# Altium schematic sheet GSM_GPS.SchDoc
size A4
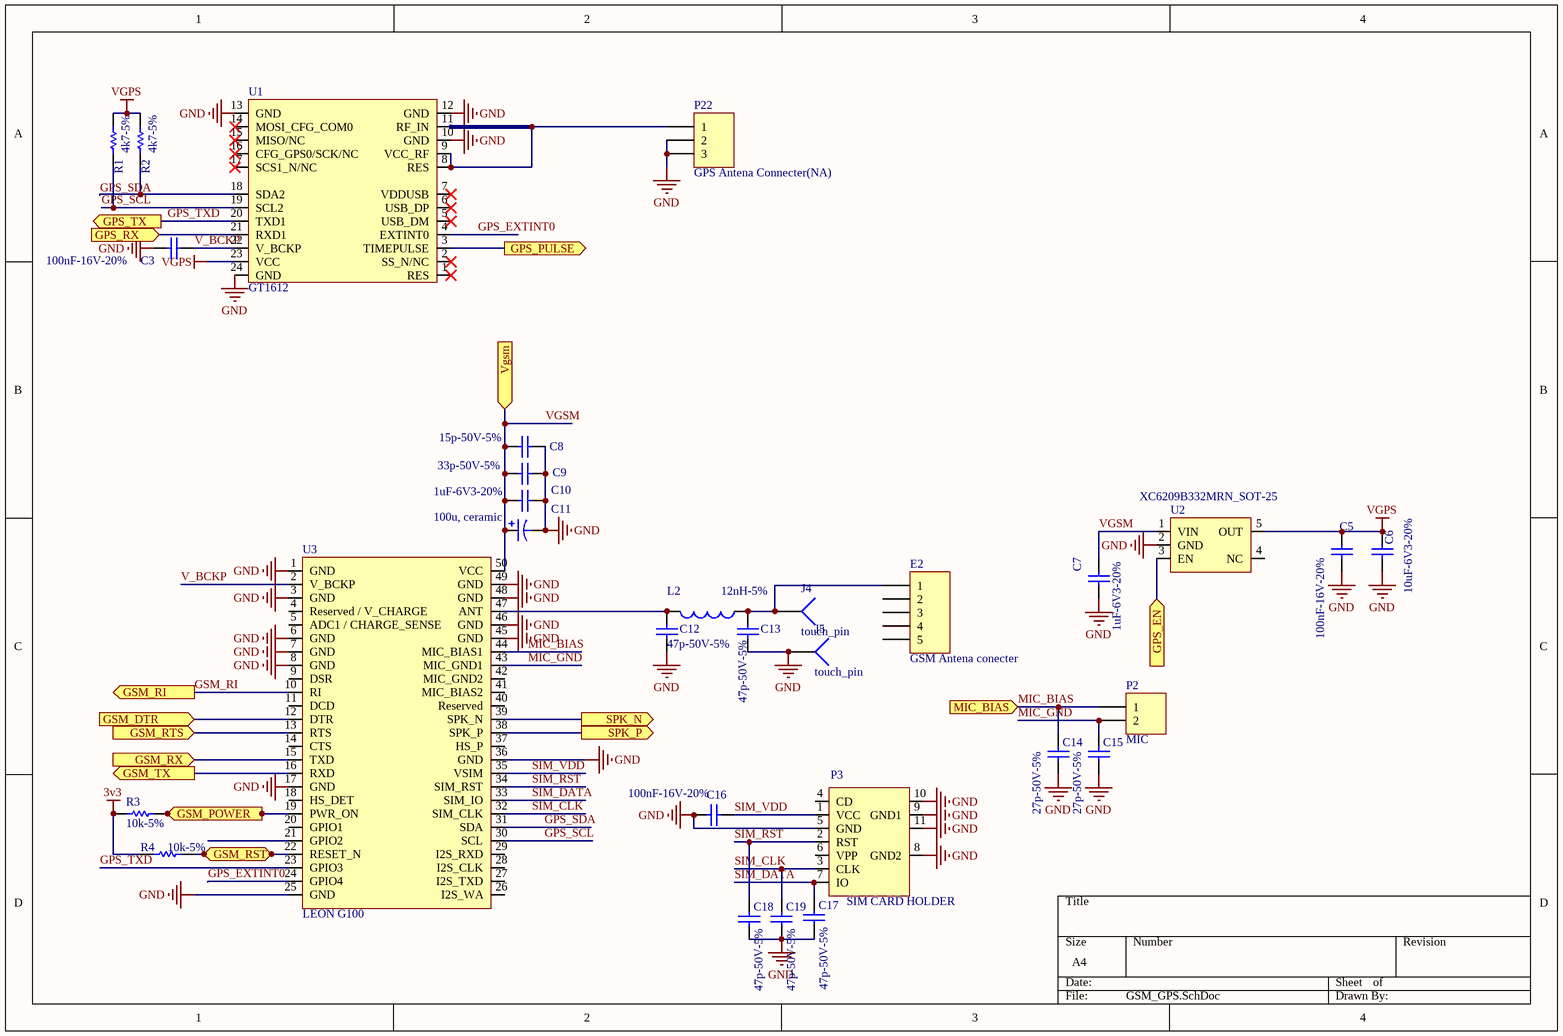
[diagram p0: GSM_GPS.SchDoc]

## Parts
C3  100nF-16V-20%  [C0402]
C5  100nF-16V-20%  [C0402]
C6  10uF-6V3-20%  [C0603]
C7  1uF-6V3-20%  [C0402]
C8  15p-50V-5%  [C0402]
C9  33p-50V-5%  [C0402]
C10  1uF-6V3-20%  [C0402]
C11  100u, ceramic  [C1210]
C12  47p-50V-5%  [C0402]
C13  47p-50V-5%  [C0402]
C14  27p-50V-5%  [C0402]
C15  27p-50V-5%  [C0402]
C16  100nF-16V-20%  [C0402]
C17  47p-50V-5%  [C0402]
C18  47p-50V-5%  [C0402]
C19  47p-50V-5%  [C0402]
E2  GSM Antena conecter  [A10343-GSM850/900/1800/1900/WCDMA]
J4  touch_pin  [TOUCH_PIN]
J5  touch_pin  [TOUCH_PIN]
L2  12nH-5%  [R0402]
P2  MIC  [HEADER_1.27mm_2PIN]
P3  SIM CARD HOLDER  [MICRO_SIM_SOCKET]
P22  GPS Antena Connecter(NA)  [IPX SMD PCB Plug]
R1  4k7-5%  [R0402]
R2  4k7-5%  [R0402]
R3  10k-5%  [R0402]
R4  10k-5%  [R0402]
U1  GT1612  [GT1612]
U2  XC6209B332MRN_SOT-25  [SOT23-5]
U3  LEON G100  [U-BLOX-G100]

## Ports
GPS_EN (in), GPS_PULSE (out), GPS_RX (in), GPS_TX (out), GSM_DTR (in), GSM_POWER (in), GSM_RI (out), GSM_RST (in), GSM_RTS (in), GSM_RX (in), GSM_TX (out), MIC_BIAS (in), SPK_N (out), SPK_P (out), Vgsm (in)

## Nets
3v3: R3.1 R4.1
GND: C3.1 C5.1 C6.1 C7.1 C8.2 C9.2 C10.1 C11.2 C12.1 C13.1 C14.1 C15.1 C16.2 C17.1 C18.1 C19.1 J5.1 P3.5(GND) P3.8(GND2) P3.9(GND1) P3.10(GND3) P3.11(GND4) P22.2 P22.3 U1.10(GND) U1.12(GND) U1.13(GND) U1.24(GND) U2.2(GND) U3.1(GND) U3.3(GND) U3.6(GND) U3.7(GND) U3.8(GND) U3.17(GND) U3.25(GND) U3.36(GND) U3.45(GND) U3.46(GND) U3.48(GND) U3.49(GND)
VGPS: C5.2 C6.2 R1.2 R2.2 U1.23(VCC) U2.5(OUT)
GPS_EN: U2.3(EN) ; port GPS_EN
GPS_EXTINT0: U1.4(EXTINT0) U3.24(GPIO4)
GPS_PULSE: U1.3(TIMEPULSE) ; port GPS_PULSE
GPS_RX: U1.21(RXD1) ; port GPS_RX
GPS_SCL: R1.1 U1.19(SCL2) U3.30(SCL)
GPS_SDA: R2.1 U1.18(SDA2) U3.31(SDA)
GPS_TXD: U1.20(TXD1) U3.23(GPIO3) ; port GPS_TX
GSM_DTR: U3.12(DTR) ; port GSM_DTR
GSM_POWER: R3.2 U3.19(PWR_ON) ; port GSM_POWER
GSM_RI: U3.10(RI) ; port GSM_RI
GSM_RST: R4.2 U3.22(RESET_N) ; port GSM_RST
GSM_RTS: U3.13(RTS) ; port GSM_RTS
GSM_RX: U3.15(TXD) ; port GSM_RX
GSM_TX: U3.16(RXD) ; port GSM_TX
MIC_BIAS: C14.2 P2.1 U3.44(MIC_BIAS1) ; port MIC_BIAS
MIC_GND: C15.2 P2.2 U3.43(MIC_GND1)
SIM_CLK: C19.2 P3.3(CLK) U3.32(SIM_CLK)
SIM_DATA: C17.2 P3.7(IO) U3.33(SIM_IO)
SIM_RST: C18.2 P3.2(RST) U3.34(SIM_RST)
SIM_VDD: C16.1 P3.1(VCC) U3.35(VSIM)
SPK_N: U3.39(SPK_N) ; port SPK_N
SPK_P: U3.38(SPK_P) ; port SPK_P
V_BCKP: C3.2 U1.22(V_BCKP) U3.2(V_BCKP)
VGSM: C7.2 C8.1 C9.1 C10.2 C11.1 U2.1(VIN) U3.50(VCC) ; port Vgsm
NetC12_2: C12.2 L2.2 U3.47(ANT)
NetC13_2: C13.2 E2.1 J4.1 L2.1
NetP22_1: P22.1 U1.8(RES) U1.9(VCC_RF) U1.11(RF_IN)

Not connected (* = marked no-connect by the designer): E2 2 3 4 5; P3 4(CD) 6(VPP); U1 1(RES)* 2(SS_N/NC)* 5(USB_DM)* 6(USB_DP)* 7(VDDUSB)* 14(MOSI_CFG_COM0)* 15(MISO/NC)* 16(CFG_GPS0/SCK/NC)* 17(SCS1_N/NC)*; U2 4(NC); U3 4(Reserved_/_V_CHARGE) 5(ADC1_/_CHARGE_SENSE) 9(DSR) 11(DCD) 14(CTS) 18(HS_DET) 20(GPIO1) 21(GPIO2) 26(I2S_WA) 27(I2S_TXD) 28(I2S_CLK) 29(I2S_RXD) 37(HS_P) 40(Reserved) 41(MIC_BIAS2) 42(MIC_GND2)

## Library data of the parts
C3 C5 C16 = Cap: CAP CER 0.1UF 16V Y5V 0402; Manufacturer: Yageo; Manufacturer Part Number: CC0402ZRY5V7BB104; Published: 8-Jun-2000; LatestRevisionDate: 17-Jul-2002; LatestRevisionNote: Re-released for DXP Platform.; PackageReference: C0402; Publisher: Altium Limited; Value: 100nF-16V-20%; Digi-Key Part Number: 311-1047-1-ND; Unit Price: 0.00250
C6 = Cap: CAP CER 10UF 6.3V 20% X5R 0603; Manufacturer: Murata Electronics North America; Manufacturer Part Number: GRM188R60J106ME47D; Published: 8-Jun-2000; LatestRevisionDate: 17-Jul-2002; LatestRevisionNote: Re-released for DXP Platform.; PackageReference: C0603; Publisher: Altium Limited; Value: 10uF-6V3-20%; Digi-Key Part Number: 490-3896-1-ND; Unit Price: 0.07873
C7 C10 = Cap: CAP CER 1UF 6.3V Y5V 0402; Manufacturer: Yageo; Manufacturer Part Number: CC0402ZRY5V5BB105; Published: 8-Jun-2000; LatestRevisionDate: 17-Jul-2002; LatestRevisionNote: Re-released for DXP Platform.; PackageReference: C0402; Publisher: Altium Limited; Value: 1uF-6V3-20%; Digi-Key Part Number: 311-1377-2-ND; Unit Price: 0.00465
C8 = Cap: CAP CER 15PF 50V 5% NPO 0402; Manufacturer: Yageo; Manufacturer Part Number: CC0402JRNPO9BN150; Published: 8-Jun-2000; LatestRevisionDate: 17-Jul-2002; LatestRevisionNote: Re-released for DXP Platform.; PackageReference: C0402; Publisher: Altium Limited; Value: 15p-50V-5%; Digi-Key Part Number: 311-1017-1-ND; Unit Price: 0.00270
C9 = Cap: CAP CER 33PF 50V 5% NPO 0402; Manufacturer: Yageo; Manufacturer Part Number: CC0402JRNPO9BN330; Published: 8-Jun-2000; LatestRevisionDate: 17-Jul-2002; LatestRevisionNote: Re-released for DXP Platform.; PackageReference: C0603; Publisher: Altium Limited; Value: 33p-50V-5%; Digi-Key Part Number: 311-1020-1-ND; Unit Price: 0.00270
C11 = Cap Pol3: CAP CER 100UF 10V 20% X5R 1812; Manufacturer Part Number: C4532X5R1A107M; Manufacturer: TDK Corporation; Published: 8-Jun-2000; LatestRevisionDate: 29-May-2009; LatestRevisionNote: IPC-7351 Footprint Added.; PackageReference: C0805; Publisher: Altium Limited; PackageDescription: Chip Capacitor; Digi-Key Part Number: 445-7743-2-ND; Unit Price: 0.55800
C12 C13 = Cap: CAP CER 47PF 50V 5% NPO 0402; Manufacturer: Yageo; Manufacturer Part Number: CC0402JRNPO9BN470; Remark: NA; Published: 8-Jun-2000; LatestRevisionDate: 17-Jul-2002; LatestRevisionNote: Re-released for DXP Platform.; PackageReference: C0603; Publisher: Altium Limited; Value: 47p-50V-5%; Digi-Key Part Number: 311-1021-1-ND; Unit Price: 0.00270
C14 C15 = Cap: CAP CER 27PF 50V 5% NPO 0402; Manufacturer: Yageo; Manufacturer Part Number: CC0402JRNPO9BN270; Description: CAP CER 47PF 50V 5% NPO 0402; Published: 8-Jun-2000; LatestRevisionDate: 17-Jul-2002; LatestRevisionNote: Re-released for DXP Platform.; PackageReference: C0603; Publisher: Altium Limited; Value: 27p-50V-5%; Digi-Key Part Number: 311-1019-2-ND; Unit Price: 0.00270
C17-C19 = Cap: CAP CER 47PF 50V 5% NPO 0402; Manufacturer: Yageo; Manufacturer Part Number: CC0402JRNPO9BN470; Published: 8-Jun-2000; LatestRevisionDate: 17-Jul-2002; LatestRevisionNote: Re-released for DXP Platform.; PackageReference: C0603; Publisher: Altium Limited; Value: 47p-50V-5%; Digi-Key Part Number: 311-1021-1-ND; Unit Price: 0.00270
E2 = Header 5: Header, 5-Pin; LatestRevisionDate: 17-Jul-2002; LatestRevisionNote: Re-released for DXP Platform.; Publisher: Altium Limited
J4 J5 = Socket: LatestRevisionDate: 17-Jul-2002; LatestRevisionNote: Re-released for DXP Platform.; Publisher: Altium Limited
L2 = Inductor: INDUCTOR 12NH 300MA 0402; Manufacturer: Murata Electronics North America; Manufacturer Part Number: LQG15HS12NJ02D; Code_IEC: 1005; Published: 8-Jun-2000; LatestRevisionDate: 29-May-2009; LatestRevisionNote: IPC-7351 Footprint Added.; PackageReference: 0402-A; Publisher: Altium Limited; PackageDescription: Chip Inductor; Code_JEITA: 0402; Value: 12nH-5%; Digi-Key Part Number: 490-2624-2-ND; Unit Price: 0.01872
P2 = Header 2: Header, 2-Pin; LatestRevisionDate: 17-Jul-2002; LatestRevisionNote: Re-released for DXP Platform.; Publisher: Altium Limited
P3 = SIM CARD: SIM _CONNECTOR_410108105011-2LF; Manufacturer: Tyrone
P22 = Header 3: GPS Antena; LatestRevisionDate: 17-Jul-2002; LatestRevisionNote: Re-released for DXP Platform.; Publisher: Altium Limited; Unit Price: 0.25; Remark: NA
R1 R2 = Res1: RES 4.7K OHM 1/16W 5% 0402 SMD; Manufacturer: Yageo; Manufacturer Part Number: RC0402JR-074K7L; Description: RES 10K OHM 1/10W 5% 0603 SMD; Published: 8-Jun-2000; LatestRevisionDate: 17-Jul-2002; LatestRevisionNote: Re-released for DXP Platform.; PackageReference: R0603; Publisher: Altium Limited; Value: 4k7-5%; Digi-Key Part Number: 311-4.7KJRCT-ND; Unit Price: 0.00178
R3 R4 = Res1: RES 10K OHM 1/16W 5% 0402 SMD; Manufacturer: Yageo; Manufacturer Part Number: RC0402JR-0710KL; Description: RES 10K OHM 1/10W 5% 0603 SMD; Published: 8-Jun-2000; LatestRevisionDate: 17-Jul-2002; LatestRevisionNote: Re-released for DXP Platform.; PackageReference: R0603; Publisher: Altium Limited; Value: 10k-5%; Digi-Key Part Number: 311-10KJRCT-ND; Unit Price: 0.00178
U1 = GPS-GT1612
U2 = XC6209B332MRN_SOT-25: Manufacturer: Tyrone
U3 = ublox: Manufacturer: Tyrone